# Altium project MaverickPowerDistribution_v1.0.PrjPcb
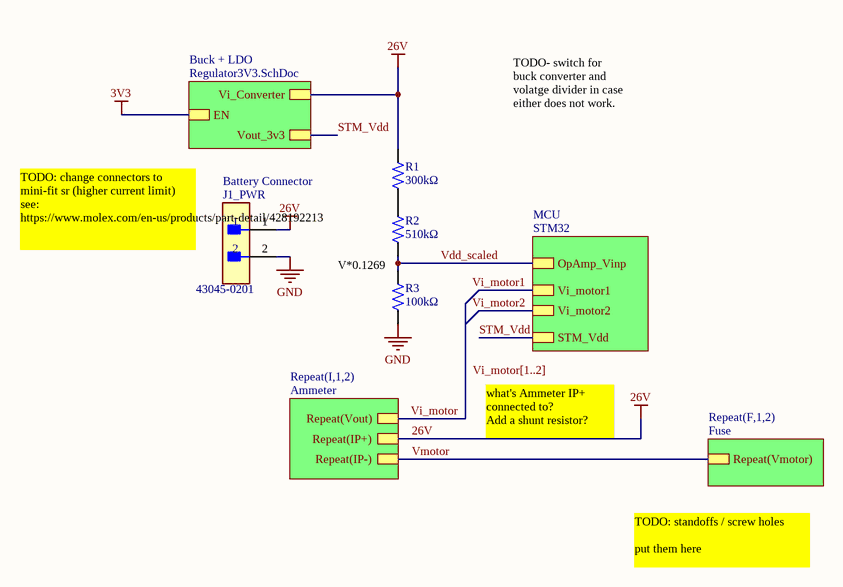
[diagram p0: Power.SchDoc]
7 sheets, 69 parts. Net scope: hierarchical (ports join the sheet entries above them; power ports are global).
Board file: PCB1.PcbDoc
Sheets:
  Power.SchDoc
    I1 = Ammeter.SchDoc
    I2 = Ammeter.SchDoc
    MCU = STM32.SchDoc
      Mass Storage = MicroSD.SchDoc
      Debugger = SWD.SchDoc
    F1 = Fuse.SchDoc
    F2 = Fuse.SchDoc
    Buck + LDO = Regulator3V3.SchDoc

## Sheet Power.SchDoc
size A; SheetNumber: 1; SheetTotal: 8

### Parts
J1_PWR  43045-0201  [FP-43045-0201-MFG]
R1  Resistance: 300kΩ  [RES-0603]  (hidden comment: 0603WAF3003T5E)
R2  Resistance: 510kΩ  [RES-0603]  (hidden comment: 0603WAF5103T5E)
R3  Resistance: 100kΩ  [RES-0402]  (hidden comment: 0402WGF1003TCE)

### Sub-sheets
Buck + LDO = Regulator3V3.SchDoc: Vi_Converter, Vout_3v3, EN
MCU = STM32: Vi_motor1, Vi_motor2, OpAmp_Vinp, STM_Vdd
Repeat(F,1,2) = Fuse: Repeat(Vmotor)
Repeat(I,1,2) = Ammeter: Repeat(Vout), Repeat(IP-), Repeat(IP+)

### Nets
26V: J1_PWR.1 R1.2 ; sheet Repeat(I,1,2)/Repeat(IP+), sheet Buck + LDO/Vi_Converter
GND: J1_PWR.2 R3.1
STM_Vdd: sheet MCU/STM_Vdd, sheet Buck + LDO/Vout_3v3
Vdd_scaled: R2.1 R3.2 ; sheet MCU/OpAmp_Vinp  [project net OPAMP1_VINP]
Vi_motor: sheet Repeat(I,1,2)/Repeat(Vout)
Vmotor: sheet Repeat(I,1,2)/Repeat(IP-), sheet Repeat(F,1,2)/Repeat(Vmotor)
NetR1_1: R1.1 R2.2

### Buses and harness runs
bus Vi_motor[1..2]

### Notes on the sheet
- (near J1_PWR) Battery Connector
- TODO- switch for buck converter and volatge divider in case either does not work.
- TODO: change connectors to mini-fit sr (higher current limit)
  see: https://www.molex.com/en-us/products/part-detail/428192213
- V*0.1269
- what's Ammeter IP+ connected to?
  Add a shunt resistor?
- TODO: standoffs / screw holes
  put them here
- Labels drawn without touching a wire or pin: Vi_motor[1..2]

### Library data of the parts
J1_PWR = CMP-04776-000998-1: CONN HEADER R/A 2POS; Number of Circuits: 2; Glow Wire Compliant: Compliant; Pitch: 3mm; Max Voltage Rating (DC): 250.25kV; Current Rating: 5A; Contact Resistance: 10mR; Gender: Male; Voltage Rating: 250V; Number of Positions: 2; Halogen Free: Low Halogen; Series: 43045; Mount: Through Hole; Packaging: Tray; Row Spacing: 3mm; Contact Material: Brass; Radiation Hardening: No; Number of Contacts: 2; Orientation: Right Angle; Max Operating Temperature: 105°C; Housing Material: Thermoplastic; Contact Plating: Gold; Case/Package: 0201; Number of Rows: 2; Min Operating Temperature: -40°C; Termination: Solder; Package Quantity: 3168
R1 = 0603WAF3003T5E: Resistor, 300kΩ, ±1%, 100mW, 75V, ±100ppm/℃, -55℃~+155℃, SMD 0603; Manufacturer: Uniroyal; Supplier 1: LCSC; Manufacturer Part Number: 0603WAF3003T5E; Supplier Part Number 1: C23024; JLCPCB Part Number: C23024; Power Rating: 100mW; Category: Resistors; Package Size: 0603; JLCPCB Basic Part: Yes; Tolerance: ±1%; Voltage Rating: 75V; Temperature Coefficient: ±100ppm/℃; Temperature Rating: -55℃~+155℃; ComponentLink1Description: Datasheet; ComponentLink1URL: https://wmsc.lcsc.com/wmsc/upload/file/pdf/v2/lcsc/2206010116_UNI-ROYAL-Uniroyal-Elec-0603WAF3003T5E_C23024.pdf; ComponentLink2Description: JLCPCB Part URL; ComponentLink2URL: https://jlcpcb.com/partdetail/C23024
R2 = 0603WAF5103T5E: Resistor, 510kΩ, ±1%, 100mW, 75V, ±100ppm/℃, -55℃~+155℃, SMD 0603; Manufacturer: Uniroyal; Supplier 1: LCSC; Manufacturer Part Number: 0603WAF5103T5E; Supplier Part Number 1: C23192; JLCPCB Part Number: C23192; Power Rating: 100mW; Category: Resistors; Package Size: 0603; JLCPCB Basic Part: Yes; Tolerance: ±1%; Voltage Rating: 75V; Temperature Coefficient: ±100ppm/℃; Temperature Rating: -55℃~+155℃; ComponentLink1Description: Datasheet; ComponentLink1URL: https://wmsc.lcsc.com/wmsc/upload/file/pdf/v2/lcsc/2206010116_UNI-ROYAL-Uniroyal-Elec-0603WAF5103T5E_C23192.pdf; ComponentLink2Description: JLCPCB Part URL; ComponentLink2URL: https://jlcpcb.com/partdetail/C23192
R3 = 0402WGF1003TCE: Resistor, 100kΩ, ±1%, 62.5mW, 50V, ±100ppm/℃, -55℃~+155℃, SMD 0402; Manufacturer: Uniroyal; Supplier 1: LCSC; Manufacturer Part Number: 0402WGF1003TCE; Supplier Part Number 1: C25741; JLCPCB Part Number: C25741; Power Rating: 62.5mW; Category: Resistors; Package Size: 0402; JLCPCB Basic Part: Yes; Tolerance: ±1%; Voltage Rating: 50V; Temperature Coefficient: ±100ppm/℃; Temperature Rating: -55℃~+155℃; ComponentLink1Description: Datasheet; ComponentLink1URL: https://wmsc.lcsc.com/wmsc/upload/file/pdf/v2/lcsc/2206010100_UNI-ROYAL-Uniroyal-Elec-0402WGF1003TCE_C25741.pdf; ComponentLink2Description: JLCPCB Part URL; ComponentLink2URL: https://jlcpcb.com/partdetail/C25741

## Sheet Ammeter.SchDoc
size A; SheetNumber: 7; SheetTotal: 8; SPICEModelCacheFFTHAXDY: <root> / <DocumentId>FFTHAXDY</DocumentId> / </root>
Used 2 times, as channels I1, I2. Parts and nets are listed once, with the designators drawn on the sheet.
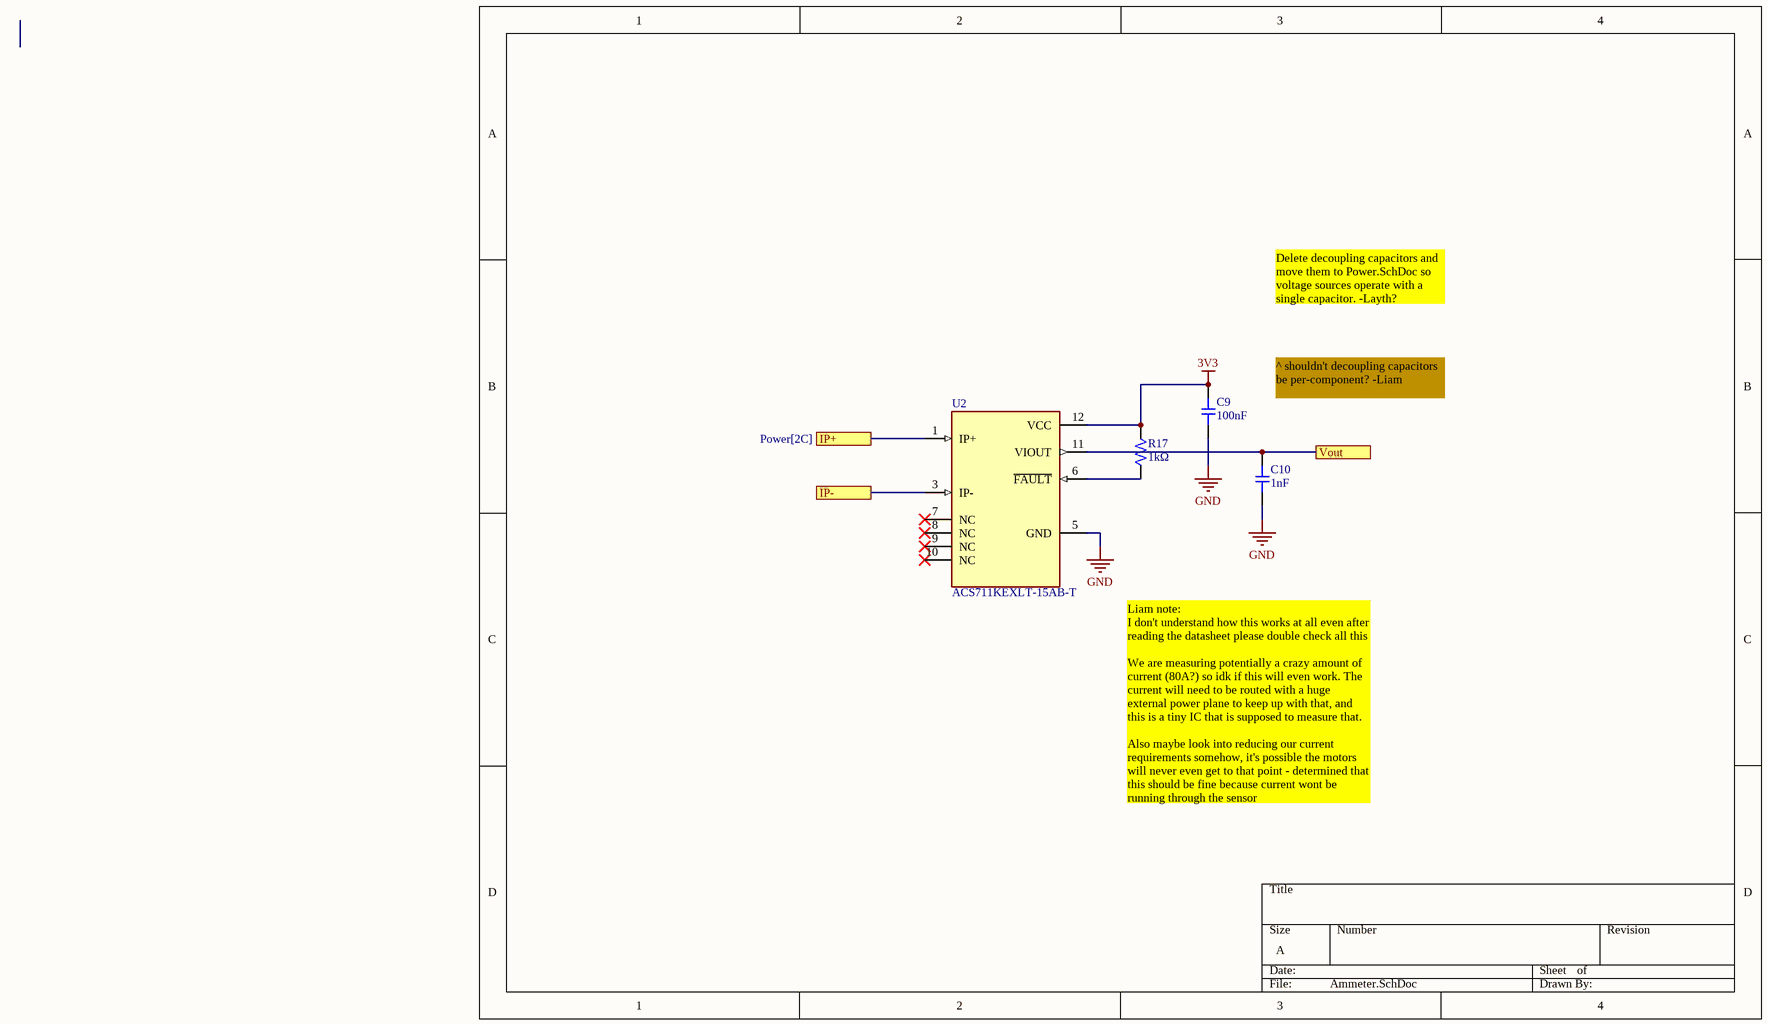
[diagram p1: Ammeter.SchDoc]

### Parts
C9  Capacitance: 100nF  [CAP-0805]  (hidden comment: CC0805KRX7R9BB104)
C10  Capacitance: 1nF  [CAP-0805]  (hidden comment: CL21B102KBCNNNC)
R17  Resistance: 1kΩ  [RES-0603]
U2  ACS711KEXLT-15AB-T  [XDCR_ACS711KEXLT-15AB-T]

### Ports
IP+ (see Power[2C]), IP- (see Power[2C]), Vout (see Power[2C])

### Nets
3V3: C9.2 R17.2 U2.12(VCC)
GND: C9.1 C10.1 U2.5(GND)
IP+: U2.1(IP+) ; port IP+
IP-: U2.3(IP-) ; port IP-
Vout: C10.2 U2.11(VIOUT) ; port Vout
NetR17_1: R17.1 U2.6(~{FAULT})

Not connected (* = marked no-connect by the designer): U2 7(NC)* 8(NC)* 9(NC)* 10(NC)*

### Channels
I1: designators end in A; ports IP+=26V1 IP-=Vmotor1 Vout=ADC1_IN9
I2: designators end in B; ports IP+=26V2 IP-=Vmotor2 Vout=ADC1_IN10

### Notes on the sheet
- Delete decoupling capacitors and move them to Power.SchDoc so voltage sources operate with a single capacitor. -Layth?
- ^ shouldn't decoupling capacitors be per-component? -Liam
- Liam note:
  I don't understand how this works at all even after reading the datasheet please double check all this
  We are measuring potentially a crazy amount of current (80A?) so idk if this will even work. The current will need to be routed with a huge external power plane to keep up with that, and this is a tiny IC that is supposed to measure that.
  Also maybe look into reducing our current requirements somehow, it's possible the motors will never even get to that point - determined that this should be fine because current wont be running through the sensor

### Library data of the parts
C9 = CC0805KRX7R9BB104: Capacitor, Ceramic (MLCC), 100nF, ±10%, 50V, X7R, ±10%, SMD 0805; Manufacturer: YAGEO; Package Size: 0805; JLCPCB Basic Part: Yes; JLCPCB Part Number: C49678; Supplier 1: LCSC; Category: Capacitors - MLCC; Supplier Part Number 1: C49678; Manufacturer Part Number: CC0805KRX7R9BB104; Tolerance: ±10%; Voltage Rating: 50V; Temperature Coefficient: X7R; RoHS: Yes; ComponentLink1Description: Datasheet; ComponentLink1URL: https://wmsc.lcsc.com/wmsc/upload/file/pdf/v2/lcsc/2304140030_YAGEO-CC0805KRX7R9BB104_C49678.pdf; ComponentLink2Description: JLCPCB Part URL; ComponentLink2URL: https://jlcpcb.com/partdetail/C49678; ComponentLink3Description: LCSC Part URL; ComponentLink3URL: https://lcsc.com/product-detail/Multilayer-Ceramic-Capacitors-MLCC---SMD-SMT_YAGEO-YAGEO-CC0805KRX7R9BB104_C49678.html
C10 = CL21B102KBCNNNC: Capacitor, Ceramic (MLCC), 1nF, ±10%, 50V, X7R, ±10%, SMD 0805; Manufacturer: Samsung Electro-Mechanics; Temperature Rating: -55°C ~ 125°C; Capacitance @ 1V DC Bias: 1.006nF; Capacitance @ 1.2V DC Bias: 1.008nF; Capacitance @ 1.35V DC Bias: 1.009nF; Capacitance @ 1.8V DC Bias: 1.011nF; Capacitance @ 2.5V DC Bias: 1.013nF; Capacitance @ 3.3V DC Bias: 1.014nF; Capacitance @ 3.7V DC Bias: 1.015nF; Capacitance @ 4.2V DC Bias: 1.017nF; Capacitance @ 5V DC Bias: 1.018nF; Capacitance @ 9V DC Bias: 1.022nF; Capacitance @ 12V DC Bias: 1.021nF; Capacitance @ 15V DC Bias: 1.020nF; Capacitance @ 24V DC Bias: 1.012nF; Capacitance @ 36V DC Bias: 0.995nF; Capacitance @ 48V DC Bias: 0.975nF; Impedance (0V Bias) @ 100Hz: 1.39E+06Ω; Impedance (0V Bias) @ 500Hz: 2.85E+05Ω; Impedance (0V Bias) @ 1kHz: 1.43E+05Ω; Impedance (0V Bias) @ 5kHz: 2.92E+04Ω; Impedance (0V Bias) @ 10kHz: 1.47E+04Ω; Impedance (0V Bias) @ 50kHz: 3E+03Ω; Impedance (0V Bias) @ 100kHz: 1.51E+03Ω; Impedance (0V Bias) @ 500kHz: 307Ω; Impedance (0V Bias) @ 1MHz: 155Ω; Impedance (0V Bias) @ 5MHz: 31.6Ω; Impedance (0V Bias) @ 10MHz: 15.9Ω; Impedance (0V Bias) @ 50MHz: 3.25Ω; Impedance (0V Bias) @ 100MHz: 1.41Ω; Impedance (0V Bias) @ 500MHz: 1.58Ω; Impedance (0V Bias) @ 1GHz: 3.83Ω; Impedance (0V Bias) @ 2GHz: 12.4Ω; Impedance (0V Bias) @ 5GHz: 7.64Ω; Package Size: 0805; JLCPCB Basic Part: Yes; JLCPCB Part Number: C46653; Supplier 1: LCSC; Category: Capacitors - MLCC; Supplier Part Number 1: C46653; Manufacturer Part Number: CL21B102KBCNNNC; Tolerance: ±10%; Voltage Rating: 50V; Temperature Coefficient: X7R; RoHS: Yes; ComponentLink1Description: Datasheet; ComponentLink1URL: https://wmsc.lcsc.com/wmsc/upload/file/pdf/v2/lcsc/2304140030_Samsung-Electro-Mechanics-CL21B102KBCNNNC_C46653.pdf; ComponentLink2Description: JLCPCB Part URL; ComponentLink2URL: https://jlcpcb.com/partdetail/C46653; ComponentLink3Description: LCSC Part URL; ComponentLink3URL: https://lcsc.com/product-detail/Multilayer-Ceramic-Capacitors-MLCC---SMD-SMT_Samsung-Electro-Mechanics-Samsung-Electro-Mechanics-CL21B102KBCNNNC_C46653.html; ComponentLink4Description: Samsung Component Library; ComponentLink4URL: https://weblib.samsungsem.com/mlcc/mlcc-ec.do?partNumber=CL21B102KBCNNN; Capacitance @ 1.5V DC Bias: 1.009nF
R17 = 0603WAF1001T5E: Resistor, 1kΩ, ±1%, 100mW, 75V, ±100ppm/℃, -55℃~+155℃, SMD 0603; Manufacturer: Uniroyal; Supplier 1: LCSC; Manufacturer Part Number: 0603WAF1001T5E; Supplier Part Number 1: C21190; JLCPCB Part Number: C21190; Power Rating: 100mW; Category: Resistors; Package Size: 0603; JLCPCB Basic Part: Yes; Tolerance: ±1%; Voltage Rating: 75V; Temperature Coefficient: ±100ppm/℃; Temperature Rating: -55℃~+155℃; ComponentLink1Description: Datasheet; ComponentLink1URL: https://wmsc.lcsc.com/wmsc/upload/file/pdf/v2/lcsc/2206010130_UNI-ROYAL-Uniroyal-Elec-0603WAF1001T5E_C21190.pdf; ComponentLink2Description: JLCPCB Part URL; ComponentLink2URL: https://jlcpcb.com/partdetail/C21190
U2 = ACS711KEXLT-15AB-T: Current Sensor 15.5A 1 Channel Hall Effect, Open Loop Bidirectional 12-PowerWFQFN; MF: Allegro MicroSystems LLC; Package: PowerWFQFN-12 Allegro MicroSystems LLC; Value: *; MP: ACS711KEXLT-15AB-T; SnapEDA_Link: https://www.snapeda.com/parts/ACS711KEXLT-15AB-T/Allegro/view-part/?ref=snap; Check_prices: https://www.snapeda.com/parts/ACS711KEXLT-15AB-T/Allegro/view-part/?ref=eda

## Sheet STM32.SchDoc
size A; SheetNumber: 3; SheetTotal: 8
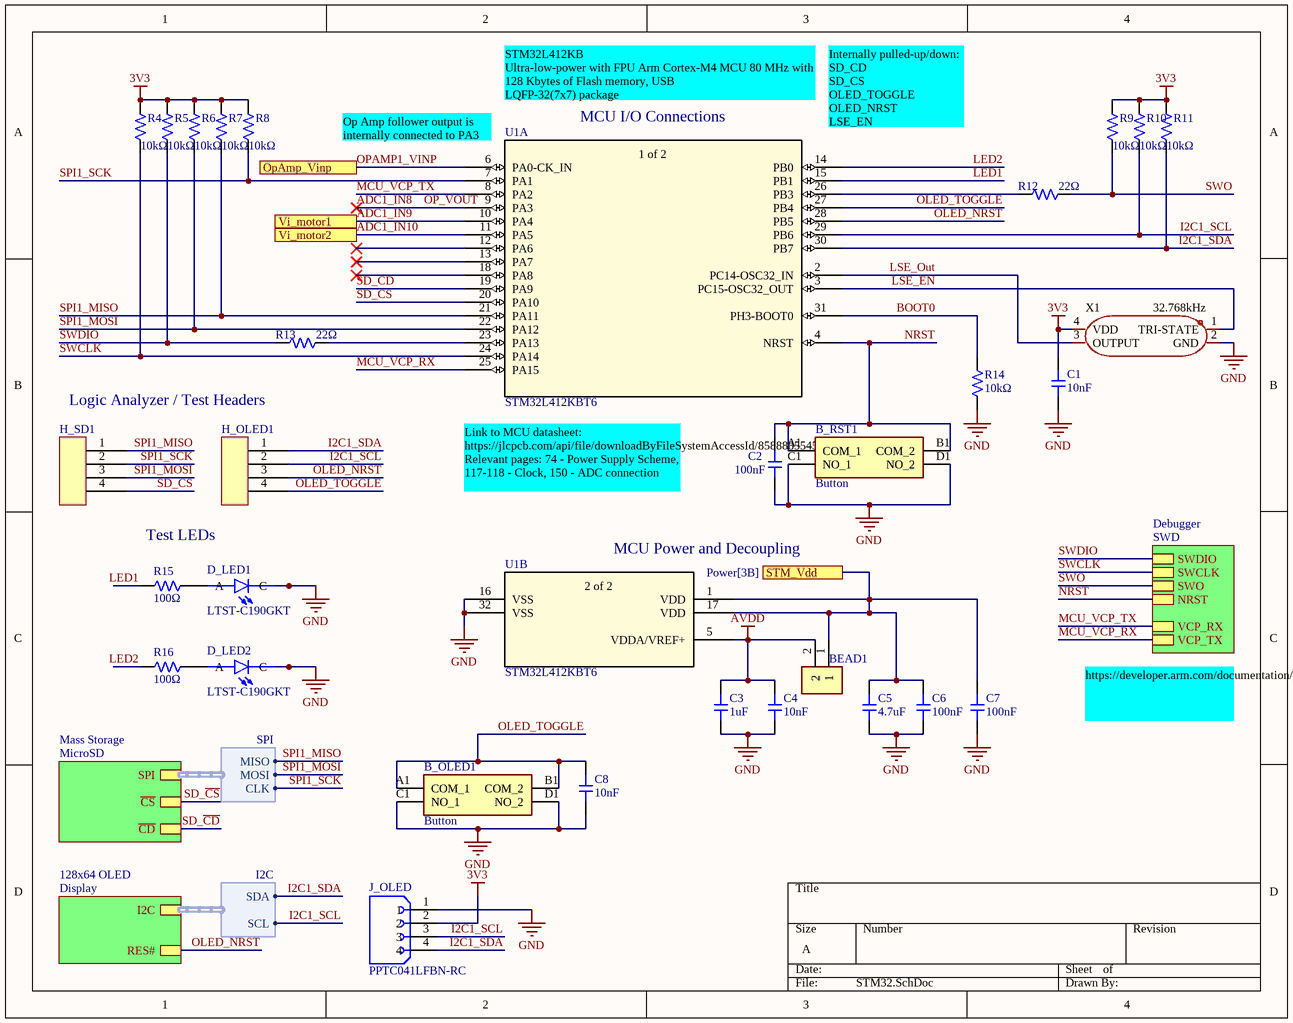
[diagram p2: STM32.SchDoc]

### Parts
B_OLED1  Button  [TS1187ABAB]
B_RST1  Button  [TS1187ABAB]
BEAD1  GZ1608D601TF  [BEADC1608X95N]  (value not drawn)
C1  Capacitance: 10nF  [CAP-0402]  (hidden comment: CL05B103KB5NNNC)
C2  Capacitance: 100nF  [CAP-0402]  (hidden comment: CL05B104KB54PNC)
C3  Capacitance: 1uF  [CAP-0402]  (hidden comment: CL05A105KA5NQNC)
C4  Capacitance: 10nF  [CAP-0402]  (hidden comment: CL05B103KB5NNNC)
C5  Capacitance: 4.7uF  [CAP-0402]  (hidden comment: CL05A475MP5NRNC)
C6  Capacitance: 100nF  [CAP-0402]  (hidden comment: CL05B104KO5NNNC)
C7  Capacitance: 100nF  [CAP-0402]  (hidden comment: CL05B104KO5NNNC)
C8  Capacitance: 10nF  [CAP-0402]  (hidden comment: CL05B103KB5NNNC)
D_LED1  LTST-C190GKT  [LEDM1608X80]
D_LED2  LTST-C190GKT  [LEDM1608X80]
H_OLED1  4-pin Header  [4-pin Header]  (value not drawn)
H_SD1  4-pin Header  [4-pin Header]  (value not drawn)
J_OLED  PPTC041LFBN-RC  [SULLINS_PPTC041LFBN-RC]
R4  Resistance: 10kΩ  [RES-0402]  (hidden comment: 0402WGF1002TCE)
R5  Resistance: 10kΩ  [RES-0402]  (hidden comment: 0402WGF1002TCE)
R6  Resistance: 10kΩ  [RES-0402]  (hidden comment: 0402WGF1002TCE)
R7  Resistance: 10kΩ  [RES-0402]  (hidden comment: 0402WGF1002TCE)
R8  Resistance: 10kΩ  [RES-0402]  (hidden comment: 0402WGF1002TCE)
R9  Resistance: 10kΩ  [RES-0402]  (hidden comment: 0402WGF1002TCE)
R10  Resistance: 10kΩ  [RES-0402]  (hidden comment: 0402WGF1002TCE)
R11  Resistance: 10kΩ  [RES-0402]  (hidden comment: 0402WGF1002TCE)
R12  Resistance: 22Ω  [RES-0402]  (hidden comment: 0402WGF220JTCE)
R13  Resistance: 22Ω  [RES-0402]  (hidden comment: 0402WGF220JTCE)
R14  Resistance: 10kΩ  [RES-0402]  (hidden comment: 0402WGF1002TCE)
R15  Resistance: 100Ω  [RES-0402]  (hidden comment: 0402WGF1000TCE)
R16  Resistance: 100Ω  [RES-0402]  (hidden comment: 0402WGF1000TCE)
U1  STM32L412KBT6  [LQFP-32]  (parts A,B of 2)
X1  32.768kHz  [OSC-SMD_4P-L3.2-W2.5-BL]

### Sub-sheets
128x64 OLED = Display (file not in this document): I2C (harness I2C), RES#
Debugger = SWD: SWDIO, SWCLK, SWO, NRST, VCP_TX, VCP_RX
Mass Storage = MicroSD: SPI (harness SPI), ~{CS}, ~{CD}

### Ports
OpAmp_Vinp (see Power[3B]), STM_Vdd (see Power[3B]), Vi_motor1 (see Power[3B]), Vi_motor2 (see Power[3B])

### Harnesses
SPI: MISO, MOSI, CLK
I2C: SDA, SCL

### Nets
3V3: C1.2 J_OLED.2 R4.2 R5.2 R6.2 R7.2 R8.2 R9.2 R10.2 R11.2 X1.4(VDD)
AVDD: BEAD1.2 C3.2 C4.2 U1.5(VDDA/VREF+)
GND: B_OLED1.C1(NO_1) B_OLED1.D1(NO_2) B_RST1.C1(NO_1) B_RST1.D1(NO_2) C1.1 C2.1 C3.1 C4.1 C5.1 C6.1 C7.1 C8.1 D_LED1.C D_LED2.C J_OLED.1 R14.1 U1.16(VSS) U1.32(VSS) X1.2(GND)
ADC1_IN8: U1.9(PA3)  [also labelled OP_VOUT]
ADC1_IN9: U1.10(PA4) ; port Vi_motor1
ADC1_IN10: U1.11(PA5) ; port Vi_motor2
BOOT0: R14.2 U1.31(PH3-BOOT0)
I2C1_SCL: H_OLED1.2 J_OLED.3 R10.1 U1.29(PB6) ; sheet 128x64 OLED/I2C.SCL
I2C1_SDA: H_OLED1.1 J_OLED.4 R11.1 U1.30(PB7) ; sheet 128x64 OLED/I2C.SDA
LED1: R15.1 U1.15(PB1)
LED2: R16.1 U1.14(PB0)
LSE_EN: U1.3(PC15-OSC32_OUT) X1.1(TRI-STATE)
LSE_Out: U1.2(PC14-OSC32_IN) X1.3(OUTPUT)
MCU_VCP_RX: U1.25(PA15) ; sheet Debugger/VCP_TX
MCU_VCP_TX: U1.8(PA2) ; sheet Debugger/VCP_RX
NRST: B_RST1.A1(COM_1) B_RST1.B1(COM_2) C2.2 U1.4(NRST) ; sheet Debugger/NRST
OLED_NRST: H_OLED1.3 U1.28(PB5) ; sheet 128x64 OLED/RES#
OLED_TOGGLE: B_OLED1.A1(COM_1) B_OLED1.B1(COM_2) C8.2 H_OLED1.4 U1.27(PB4)
OPAMP1_VINP: U1.6(PA0-CK_IN) ; port OpAmp_Vinp
SD_~{CD}: U1.19(PA9) ; sheet Mass Storage/~{CD}  [project net CardDetect]
SD_~{CS}: H_SD1.4 U1.20(PA10) ; sheet Mass Storage/~{CS}  [project net ~{CS}]
SPI1_MISO: H_SD1.1 R7.1 U1.21(PA11) ; sheet Mass Storage/SPI.MISO  [project net SPI.MISO]
SPI1_MOSI: H_SD1.3 R6.1 U1.22(PA12) ; sheet Mass Storage/SPI.MOSI  [project net SPI.MOSI]
SPI1_SCK: H_SD1.2 R8.1 U1.7(PA1) ; sheet Mass Storage/SPI.CLK  [project net SPI.CLK]
STM_Vdd: BEAD1.1 C5.2 C6.2 C7.2 U1.1(VDD) U1.17(VDD) ; port STM_Vdd
SWCLK: R4.1 U1.24(PA14) ; sheet Debugger/SWCLK
SWDIO: R5.1 R13.1 ; sheet Debugger/SWDIO
SWO: R9.1 R12.2 ; sheet Debugger/SWO
NetD_LED1_A: D_LED1.A R15.2
NetD_LED2_A: D_LED2.A R16.2
NetR12_1: R12.1 U1.26(PB3)
NetR13_2: R13.2 U1.23(PA13)

Not connected (* = marked no-connect by the designer): U1 12(PA6)* 13(PA7)* 18(PA8)*

### Notes on the sheet
- STM32L412KB
  Ultra-low-power with FPU Arm Cortex-M4 MCU 80 MHz with 128 Kbytes of Flash memory, USB
  LQFP-32(7x7) package
- (near U1) Op Amp follower output is internally connected to PA3
- (near U1) MCU I/O Connections
- (near U1) Internally pulled-up/down:
  SD_CD
  SD_CS
  OLED_TOGGLE
  OLED_NRST
  LSE_EN
- Logic Analyzer / Test Headers
- Link to MCU datasheet: https://jlcpcb.com/api/file/downloadByFileSystemAccessId/8588885545674424320
  Relevant pages: 74 - Power Supply Scheme, 117-118 - Clock, 150 - ADC connection
- Test LEDs
- MCU Power and Decoupling
- https://developer.arm.com/documentation/dui0499/a/Target-Interface-Connections/SWD-connections
- (in symbol STM32L412KBT6, part A) 1 of 2
- (in symbol STM32L412KBT6, part B) 2 of 2

### Library data of the parts
B_OLED1 B_RST1 = TS-1187A-B-A-B: Manufacturer_Name: XKB Connectivity; Datasheet Link: http://www.helloxkb.com/public/images/pdf/TS-1187A-X-X-X.pdf; Height: 4.05mm; Manufacturer_Part_Number: TS-1187A-B-A-B
BEAD1 = GZ1608D601TF: Ferrite Bead; Manufacturer_Name: SUNLORD; Datasheet Link: https://datasheet.lcsc.com/szlcsc/Sunlord-GZ1608D601TF_C1002.pdf; Height: 0.95mm; Manufacturer_Part_Number: GZ1608D601TF
C1 C4 C8 = CL05B103KB5NNNC: Capacitor, Ceramic (MLCC), 10nF, ±10%, 50V, X7R, ±10%, SMD 0402; Manufacturer: Samsung Electro-Mechanics; Temperature Rating: -55°C ~ 125°C; Capacitance @ 1V DC Bias: 10.426nF; Capacitance @ 1.2V DC Bias: 10.434nF; Capacitance @ 1.35V DC Bias: 10.444nF; Capacitance @ 1.5V DC Bias: 10.455nF; Capacitance @ 1.8V DC Bias: 10.480nF; Capacitance @ 2.5V DC Bias: 10.514nF; Capacitance @ 3.3V DC Bias: 10.519nF; Capacitance @ 3.7V DC Bias: 10.504nF; Capacitance @ 4.2V DC Bias: 10.473nF; Capacitance @ 5V DC Bias: 10.402nF; Capacitance @ 9V DC Bias: 10.052nF; Capacitance @ 12V DC Bias: 9.639nF; Capacitance @ 15V DC Bias: 9.187nF; Capacitance @ 24V DC Bias: 7.606nF; Capacitance @ 36V DC Bias: 5.499nF; Capacitance @ 48V DC Bias: 3.591nF; Impedance (0V Bias) @ 100Hz: 1.57E+05Ω; Impedance (0V Bias) @ 500Hz: 3.19E+04Ω; Impedance (0V Bias) @ 1kHz: 1.61E+04Ω; Impedance (0V Bias) @ 5kHz: 3.27E+03Ω; Impedance (0V Bias) @ 10kHz: 1.65E+03Ω; Impedance (0V Bias) @ 50kHz: 335Ω; Impedance (0V Bias) @ 100kHz: 169Ω; Impedance (0V Bias) @ 500kHz: 34.3Ω; Impedance (0V Bias) @ 1MHz: 17.3Ω; Impedance (0V Bias) @ 5MHz: 3.52Ω; Impedance (0V Bias) @ 10MHz: 1.77Ω; Impedance (0V Bias) @ 50MHz: 0.285Ω; Impedance (0V Bias) @ 100MHz: 0.0835Ω; Impedance (0V Bias) @ 500MHz: 0.751Ω; Impedance (0V Bias) @ 1GHz: 1.42Ω; Impedance (0V Bias) @ 2GHz: 3.22Ω; Impedance (0V Bias) @ 5GHz: 6.48Ω; Package Size: 0402; JLCPCB Basic Part: Yes; JLCPCB Part Number: C15195; Supplier 1: LCSC; Category: Capacitors - MLCC; Supplier Part Number 1: C15195; Manufacturer Part Number: CL05B103KB5NNNC; Tolerance: ±10%; Voltage Rating: 50V; Temperature Coefficient: X7R; RoHS: Yes; ComponentLink1Description: Datasheet; ComponentLink1URL: https://wmsc.lcsc.com/wmsc/upload/file/pdf/v2/lcsc/2304140030_Samsung-Electro-Mechanics-CL05B103KB5NNNC_C15195.pdf; ComponentLink2Description: JLCPCB Part URL; ComponentLink2URL: https://jlcpcb.com/partdetail/C15195; ComponentLink3Description: LCSC Part URL; ComponentLink3URL: https://lcsc.com/product-detail/Multilayer-Ceramic-Capacitors-MLCC---SMD-SMT_Samsung-Electro-Mechanics-Samsung-Electro-Mechanics-CL05B103KB5NNNC_C15195.html; ComponentLink4Description: Samsung Component Library; ComponentLink4URL: https://weblib.samsungsem.com/mlcc/mlcc-ec.do?partNumber=CL05B103KB5NNN
C2 = CL05B104KB54PNC: Capacitor, Ceramic (MLCC), 100nF, ±10%, 50V, X7R, ±10%, SMD 0402; Manufacturer: Samsung Electro-Mechanics; Temperature Rating: -55°C ~ 125°C; Capacitance @ 1V DC Bias: 105.687nF; Capacitance @ 1.2V DC Bias: 105.639nF; Capacitance @ 1.35V DC Bias: 105.594nF; Capacitance @ 1.5V DC Bias: 105.528nF; Capacitance @ 1.8V DC Bias: 105.317nF; Capacitance @ 2.5V DC Bias: 104.216nF; Capacitance @ 3.3V DC Bias: 102.385nF; Capacitance @ 3.7V DC Bias: 101.236nF; Capacitance @ 4.2V DC Bias: 99.650nF; Capacitance @ 5V DC Bias: 96.918nF; Capacitance @ 9V DC Bias: 81.073nF; Capacitance @ 12V DC Bias: 69.786nF; Capacitance @ 15V DC Bias: 59.475nF; Capacitance @ 24V DC Bias: 38.112nF; Capacitance @ 36V DC Bias: 23.027nF; Capacitance @ 48V DC Bias: 16.035nF; Impedance (0V Bias) @ 100Hz: 1.66E+04Ω; Impedance (0V Bias) @ 500Hz: 3.38E+03Ω; Impedance (0V Bias) @ 1kHz: 1.7E+03Ω; Impedance (0V Bias) @ 5kHz: 346Ω; Impedance (0V Bias) @ 10kHz: 175Ω; Impedance (0V Bias) @ 50kHz: 35.5Ω; Impedance (0V Bias) @ 100kHz: 17.9Ω; Impedance (0V Bias) @ 500kHz: 3.64Ω; Impedance (0V Bias) @ 1MHz: 1.84Ω; Impedance (0V Bias) @ 5MHz: 0.366Ω; Impedance (0V Bias) @ 10MHz: 0.172Ω; Impedance (0V Bias) @ 50MHz: 0.0626Ω; Impedance (0V Bias) @ 100MHz: 0.128Ω; Impedance (0V Bias) @ 500MHz: 0.487Ω; Impedance (0V Bias) @ 1GHz: 0.87Ω; Impedance (0V Bias) @ 2GHz: 2Ω; Impedance (0V Bias) @ 5GHz: 3.96Ω; Package Size: 0402; JLCPCB Basic Part: Yes; JLCPCB Part Number: C307331; Supplier 1: LCSC; Category: Capacitors - MLCC; Supplier Part Number 1: C307331; Manufacturer Part Number: CL05B104KB54PNC; Tolerance: ±10%; Voltage Rating: 50V; Temperature Coefficient: X7R; RoHS: Yes; ComponentLink1Description: Datasheet; ComponentLink1URL: https://wmsc.lcsc.com/wmsc/upload/file/pdf/v2/lcsc/2304140030_Samsung-Electro-Mechanics-CL05B104KB54PNC_C307331.pdf; ComponentLink2Description: JLCPCB Part URL; ComponentLink2URL: https://jlcpcb.com/partdetail/C307331; ComponentLink3Description: LCSC Part URL; ComponentLink3URL: https://lcsc.com/product-detail/Multilayer-Ceramic-Capacitors-MLCC---SMD-SMT_Samsung-Electro-Mechanics-Samsung-Electro-Mechanics-CL05B104KB54PNC_C307331.html; ComponentLink4Description: Samsung Component Library; ComponentLink4URL: https://weblib.samsungsem.com/mlcc/mlcc-ec.do?partNumber=CL05B104KB54PN
C3 = CL05A105KA5NQNC: Capacitor, Ceramic (MLCC), 1uF, ±10%, 25V, X5R, ±10%, SMD 0402; Manufacturer: Samsung Electro-Mechanics; Temperature Rating: -55°C ~ 85°C; Capacitance @ 1V DC Bias: 1.014uF; Capacitance @ 1.2V DC Bias: 0.983uF; Capacitance @ 1.35V DC Bias: 0.958uF; Capacitance @ 1.5V DC Bias: 0.932uF; Capacitance @ 1.8V DC Bias: 0.879uF; Capacitance @ 2.5V DC Bias: 0.755uF; Capacitance @ 3.3V DC Bias: 0.618uF; Capacitance @ 3.7V DC Bias: 0.562uF; Capacitance @ 4.2V DC Bias: 0.501uF; Capacitance @ 5V DC Bias: 0.420uF; Capacitance @ 9V DC Bias: 0.204uF; Capacitance @ 12V DC Bias: 0.147uF; Capacitance @ 15V DC Bias: 0.107uF; Capacitance @ 24V DC Bias: 0.061uF; Impedance (0V Bias) @ 100Hz: 1.95E+03Ω; Impedance (0V Bias) @ 500Hz: 402Ω; Impedance (0V Bias) @ 1kHz: 204Ω; Impedance (0V Bias) @ 5kHz: 42Ω; Impedance (0V Bias) @ 10kHz: 21.3Ω; Impedance (0V Bias) @ 50kHz: 4.4Ω; Impedance (0V Bias) @ 100kHz: 2.23Ω; Impedance (0V Bias) @ 500kHz: 0.462Ω; Impedance (0V Bias) @ 1MHz: 0.234Ω; Impedance (0V Bias) @ 5MHz: 0.0392Ω; Impedance (0V Bias) @ 10MHz: 0.0118Ω; Impedance (0V Bias) @ 50MHz: 0.0671Ω; Impedance (0V Bias) @ 100MHz: 0.118Ω; Impedance (0V Bias) @ 500MHz: 0.452Ω; Impedance (0V Bias) @ 1GHz: 0.812Ω; Impedance (0V Bias) @ 2GHz: 1.8Ω; Impedance (0V Bias) @ 5GHz: 3.57Ω; Impedance (25V Bias) @ 100Hz: 2.62E+04Ω; Impedance (25V Bias) @ 500Hz: 5.28E+03Ω; Impedance (25V Bias) @ 1kHz: 2.65E+03Ω; Impedance (25V Bias) @ 5kHz: 533Ω; Impedance (25V Bias) @ 10kHz: 267Ω; Impedance (25V Bias) @ 50kHz: 53.8Ω; Impedance (25V Bias) @ 100kHz: 27Ω; Impedance (25V Bias) @ 500kHz: 5.42Ω; Impedance (25V Bias) @ 1MHz: 2.7Ω; Impedance (25V Bias) @ 5MHz: 0.621Ω; Impedance (25V Bias) @ 10MHz: 0.298Ω; Impedance (25V Bias) @ 50MHz: 0.0523Ω; Impedance (25V Bias) @ 100MHz: 0.113Ω; Impedance (25V Bias) @ 500MHz: 0.451Ω; Impedance (25V Bias) @ 1GHz: 0.82Ω; Impedance (25V Bias) @ 2GHz: 1.85Ω; Impedance (25V Bias) @ 5GHz: 3.51Ω; Package Size: 0402; JLCPCB Basic Part: Yes; JLCPCB Part Number: C52923; Supplier 1: LCSC; Category: Capacitors - MLCC; Supplier Part Number 1: C52923; Manufacturer Part Number: CL05A105KA5NQNC; Tolerance: ±10%; Voltage Rating: 25V; Temperature Coefficient: X5R; RoHS: Yes; ComponentLink1Description: Datasheet; ComponentLink1URL: https://wmsc.lcsc.com/wmsc/upload/file/pdf/v2/lcsc/2304140030_Samsung-Electro-Mechanics-CL05A105KA5NQNC_C52923.pdf; ComponentLink2Description: JLCPCB Part URL; ComponentLink2URL: https://jlcpcb.com/partdetail/C52923; ComponentLink3Description: LCSC Part URL; ComponentLink3URL: https://lcsc.com/product-detail/Multilayer-Ceramic-Capacitors-MLCC---SMD-SMT_Samsung-Electro-Mechanics-Samsung-Electro-Mechanics-CL05A105KA5NQNC_C52923.html; ComponentLink4Description: Samsung Component Library; ComponentLink4URL: https://weblib.samsungsem.com/mlcc/mlcc-ec.do?partNumber=CL05A105KA5NQN
C5 = CL05A475MP5NRNC: Capacitor, Ceramic (MLCC), 4.7uF, ±20%, 10V, X5R, ±20%, SMD 0402; Manufacturer: Samsung Electro-Mechanics; Temperature Rating: -55°C ~ 85°C; Capacitance @ 1V DC Bias: 4.048uF; Capacitance @ 1.2V DC Bias: 3.816uF; Capacitance @ 1.35V DC Bias: 3.633uF; Capacitance @ 1.5V DC Bias: 3.450uF; Capacitance @ 1.8V DC Bias: 3.100uF; Capacitance @ 2.5V DC Bias: 2.453uF; Capacitance @ 3.3V DC Bias: 1.872uF; Capacitance @ 3.7V DC Bias: 1.663uF; Capacitance @ 4.2V DC Bias: 1.455uF; Capacitance @ 5V DC Bias: 1.191uF; Capacitance @ 9V DC Bias: 0.548uF; Impedance (0V Bias) @ 100Hz: 442Ω; Impedance (0V Bias) @ 500Hz: 90.2Ω; Impedance (0V Bias) @ 1kHz: 45.6Ω; Impedance (0V Bias) @ 5kHz: 9.34Ω; Impedance (0V Bias) @ 10kHz: 4.72Ω; Impedance (0V Bias) @ 50kHz: 0.964Ω; Impedance (0V Bias) @ 100kHz: 0.486Ω; Impedance (0V Bias) @ 500kHz: 0.0987Ω; Impedance (0V Bias) @ 1MHz: 0.0479Ω; Impedance (0V Bias) @ 5MHz: 0.00709Ω; Impedance (0V Bias) @ 10MHz: 0.0183Ω; Impedance (0V Bias) @ 50MHz: 0.06Ω; Impedance (0V Bias) @ 100MHz: 0.102Ω; Impedance (0V Bias) @ 500MHz: 0.377Ω; Impedance (0V Bias) @ 1GHz: 0.66Ω; Impedance (0V Bias) @ 2GHz: 1.52Ω; Impedance (0V Bias) @ 5GHz: 3.05Ω; Impedance (10V Bias) @ 100Hz: 3.34E+03Ω; Impedance (10V Bias) @ 500Hz: 674Ω; Impedance (10V Bias) @ 1kHz: 338Ω; Impedance (10V Bias) @ 5kHz: 68.2Ω; Impedance (10V Bias) @ 10kHz: 34.2Ω; Impedance (10V Bias) @ 50kHz: 6.88Ω; Impedance (10V Bias) @ 100kHz: 3.45Ω; Impedance (10V Bias) @ 500kHz: 0.693Ω; Impedance (10V Bias) @ 1MHz: 0.344Ω; Impedance (10V Bias) @ 5MHz: 0.0603Ω; Impedance (10V Bias) @ 10MHz: 0.0164Ω; Impedance (10V Bias) @ 50MHz: 0.064Ω; Impedance (10V Bias) @ 100MHz: 0.105Ω; Impedance (10V Bias) @ 500MHz: 0.385Ω; Impedance (10V Bias) @ 1GHz: 0.673Ω; Impedance (10V Bias) @ 5GHz: 3.06Ω; Package Size: 0402; JLCPCB Basic Part: Yes; JLCPCB Part Number: C23733; Supplier 1: LCSC; Category: Capacitors - MLCC; Supplier Part Number 1: C23733; Manufacturer Part Number: CL05A475MP5NRNC; Tolerance: ±20%; Voltage Rating: 10V; Temperature Coefficient: X5R; RoHS: Yes; ComponentLink1Description: Datasheet; ComponentLink1URL: https://wmsc.lcsc.com/wmsc/upload/file/pdf/v2/lcsc/2304140030_Samsung-Electro-Mechanics-CL05A475MP5NRNC_C23733.pdf; ComponentLink2Description: JLCPCB Part URL; ComponentLink2URL: https://jlcpcb.com/partdetail/C23733; ComponentLink3Description: LCSC Part URL; ComponentLink3URL: https://lcsc.com/product-detail/Multilayer-Ceramic-Capacitors-MLCC---SMD-SMT_Samsung-Electro-Mechanics-Samsung-Electro-Mechanics-CL05A475MP5NRNC_C23733.html; ComponentLink4Description: Samsung Component Library; ComponentLink4URL: https://weblib.samsungsem.com/mlcc/mlcc-ec.do?partNumber=CL05A475MP5NRN; Impedance (10V Bias) @ 2GHz: 1.52Ω
C6 C7 = CL05B104KO5NNNC: Capacitor, Ceramic (MLCC), 100nF, ±10%, 16V, X7R, ±10%, SMD 0402; Manufacturer: Samsung Electro-Mechanics; Temperature Rating: -55°C ~ 125°C; Capacitance @ 1V DC Bias: 104.721nF; Capacitance @ 1.2V DC Bias: 104.598nF; Capacitance @ 1.35V DC Bias: 104.495nF; Capacitance @ 1.5V DC Bias: 104.372nF; Capacitance @ 1.8V DC Bias: 104.042nF; Capacitance @ 2.5V DC Bias: 102.634nF; Capacitance @ 3.3V DC Bias: 100.452nF; Capacitance @ 3.7V DC Bias: 99.160nF; Capacitance @ 4.2V DC Bias: 97.441nF; Capacitance @ 5V DC Bias: 94.577nF; Capacitance @ 9V DC Bias: 78.638nF; Capacitance @ 12V DC Bias: 66.291nF; Capacitance @ 15V DC Bias: 54.779nF; Impedance (0V Bias) @ 100Hz: 1.71E+04Ω; Impedance (0V Bias) @ 500Hz: 3.48E+03Ω; Impedance (0V Bias) @ 1kHz: 1.75E+03Ω; Impedance (0V Bias) @ 5kHz: 356Ω; Impedance (0V Bias) @ 10kHz: 179Ω; Impedance (0V Bias) @ 50kHz: 36.4Ω; Impedance (0V Bias) @ 100kHz: 18.3Ω; Impedance (0V Bias) @ 500kHz: 3.72Ω; Impedance (0V Bias) @ 1MHz: 1.87Ω; Impedance (0V Bias) @ 5MHz: 0.373Ω; Impedance (0V Bias) @ 10MHz: 0.175Ω; Impedance (0V Bias) @ 50MHz: 0.064Ω; Impedance (0V Bias) @ 100MHz: 0.122Ω; Impedance (0V Bias) @ 500MHz: 0.525Ω; Impedance (0V Bias) @ 1GHz: 0.97Ω; Impedance (0V Bias) @ 2GHz: 2.26Ω; Impedance (0V Bias) @ 5GHz: 4.75Ω; Impedance (16V Bias) @ 100Hz: 2.55E+04Ω; Impedance (16V Bias) @ 500Hz: 5.18E+03Ω; Impedance (16V Bias) @ 1kHz: 2.61E+03Ω; Impedance (16V Bias) @ 5kHz: 529Ω; Impedance (16V Bias) @ 10kHz: 266Ω; Impedance (16V Bias) @ 50kHz: 54Ω; Impedance (16V Bias) @ 100kHz: 27.2Ω; Impedance (16V Bias) @ 500kHz: 5.5Ω; Impedance (16V Bias) @ 1MHz: 2.76Ω; Impedance (16V Bias) @ 5MHz: 0.587Ω; Impedance (16V Bias) @ 10MHz: 0.277Ω; Impedance (16V Bias) @ 50MHz: 0.0412Ω; Impedance (16V Bias) @ 100MHz: 0.133Ω; Impedance (16V Bias) @ 500MHz: 0.524Ω; Impedance (16V Bias) @ 1GHz: 0.969Ω; Impedance (16V Bias) @ 2GHz: 2.25Ω; Impedance (16V Bias) @ 5GHz: 4.7Ω; Package Size: 0402; JLCPCB Basic Part: Yes; JLCPCB Part Number: C1525; Supplier 1: LCSC; Category: Capacitors - MLCC; Supplier Part Number 1: C1525; Manufacturer Part Number: CL05B104KO5NNNC; Tolerance: ±10%; Voltage Rating: 16V; Temperature Coefficient: X7R; RoHS: Yes; ComponentLink1Description: Datasheet; ComponentLink1URL: https://wmsc.lcsc.com/wmsc/upload/file/pdf/v2/lcsc/2304140030_Samsung-Electro-Mechanics-CL05B104KO5NNNC_C1525.pdf; ComponentLink2Description: JLCPCB Part URL; ComponentLink2URL: https://jlcpcb.com/partdetail/C1525; ComponentLink3Description: LCSC Part URL; ComponentLink3URL: https://lcsc.com/product-detail/Multilayer-Ceramic-Capacitors-MLCC---SMD-SMT_Samsung-Electro-Mechanics-Samsung-Electro-Mechanics-CL05B104KO5NNNC_C1525.html; ComponentLink4Description: Samsung Component Library; ComponentLink4URL: https://weblib.samsungsem.com/mlcc/mlcc-ec.do?partNumber=CL05B104KO5NNN
D_LED1 D_LED2 = LTST-C190GKT: MF: {'manufacturer': u'Lite-On Inc.'}; Package: None; Price: None; Value: *; MP: LTST-C190GKT; Availability: Unavailable
H_OLED1 H_SD1 = 4-pin Header: 4-pin Header 0.1mm pitch
J_OLED = PPTC041LFBN-RC: 4 Position Header Connector 0.100 (2.54mm) Through Hole Tin; MF: Sullins Connector; SnapEDA_Link: https://www.snapeda.com/parts/PPTC041LFBN-RC/Sullins/view-part/?ref=snap; Package: None; Value: *; MP: PPTC041LFBN-RC; Check_prices: https://www.snapeda.com/parts/PPTC041LFBN-RC/Sullins/view-part/?ref=eda
R4-R11 R14 = 0402WGF1002TCE: Resistor, 10kΩ, ±1%, 62.5mW, 50V, ±100ppm/℃, -55℃~+155℃, SMD 0402; Manufacturer: Uniroyal; Supplier 1: LCSC; Manufacturer Part Number: 0402WGF1002TCE; Supplier Part Number 1: C25744; JLCPCB Part Number: C25744; Power Rating: 62.5mW; Category: Resistors; Package Size: 0402; JLCPCB Basic Part: Yes; Tolerance: ±1%; Voltage Rating: 50V; Temperature Coefficient: ±100ppm/℃; Temperature Rating: -55℃~+155℃; ComponentLink1Description: Datasheet; ComponentLink1URL: https://wmsc.lcsc.com/wmsc/upload/file/pdf/v2/lcsc/2206010100_UNI-ROYAL-Uniroyal-Elec-0402WGF1002TCE_C25744.pdf; ComponentLink2Description: JLCPCB Part URL; ComponentLink2URL: https://jlcpcb.com/partdetail/C25744
R12 R13 = 0402WGF220JTCE: Resistor, 22Ω, ±1%, 62.5mW, 50V, ±200ppm/℃, -55℃~+155℃, SMD 0402; Manufacturer: Uniroyal; Supplier 1: LCSC; Manufacturer Part Number: 0402WGF220JTCE; Supplier Part Number 1: C25092; JLCPCB Part Number: C25092; Power Rating: 62.5mW; Category: Resistors; Package Size: 0402; JLCPCB Basic Part: Yes; Tolerance: ±1%; Voltage Rating: 50V; Temperature Coefficient: ±200ppm/℃; Temperature Rating: -55℃~+155℃; ComponentLink1Description: Datasheet; ComponentLink1URL: https://wmsc.lcsc.com/wmsc/upload/file/pdf/v2/lcsc/2205311900_UNI-ROYAL-Uniroyal-Elec-0402WGF220JTCE_C25092.pdf; ComponentLink2Description: JLCPCB Part URL; ComponentLink2URL: https://jlcpcb.com/partdetail/C25092
R15 R16 = 0402WGF1000TCE: Resistor, 100Ω, ±1%, 62.5mW, 50V, ±200ppm/℃, -55℃~+155℃, SMD 0402; Manufacturer: Uniroyal; Supplier 1: LCSC; Manufacturer Part Number: 0402WGF1000TCE; Supplier Part Number 1: C25076; JLCPCB Part Number: C25076; Power Rating: 62.5mW; Category: Resistors; Package Size: 0402; JLCPCB Basic Part: Yes; Tolerance: ±1%; Voltage Rating: 50V; Temperature Coefficient: ±200ppm/℃; Temperature Rating: -55℃~+155℃; ComponentLink1Description: Datasheet; ComponentLink1URL: https://wmsc.lcsc.com/wmsc/upload/file/pdf/v2/lcsc/2205311900_UNI-ROYAL-Uniroyal-Elec-0402WGF1000TCE_C25076.pdf; ComponentLink2Description: JLCPCB Part URL; ComponentLink2URL: https://jlcpcb.com/partdetail/C25076
U1 = STM32L412KBT6: No Description Available; Mfr_Name: STMicroelectronics; RefDes: RefDes; Type: Type
X1 = SX3M32.768KM20F30TNN: Manufacturer: SCTF(星通时频); Add into BOM: yes; Normal temperature Frequency Tolerance: ±20ppm; Output Type: CMOS; Voltage - Supply: 1.62V~3.63V; Current - Supply: 90uA; Frequency Stability: ±30ppm; Symbol: SX3M32.768KM20F30TNN; Device: SX3M32.768KM20F30TNN; LCSC Part Name: 32.768kHz ±20ppm 1.62V~3.63V CMOS; Supplier Part: C2901582; Manufacturer Part: SX3M32.768KM20F30TNN; Supplier Footprint: SMD3225-4P; JLCPCB Part Class: Extended Part; Datasheet: https://atta.szlcsc.com/upload/public/pdf/source/20240605/38A6F081BC26201D4BADAAB4D2EED01C.pdf; Supplier: LCSC; Convert to PCB: yes; Value: 32.768kHz; Operating Temperature: -40℃~+85℃

## Sheet MicroSD.SchDoc
size A; SheetNumber: 4; SheetTotal: 8
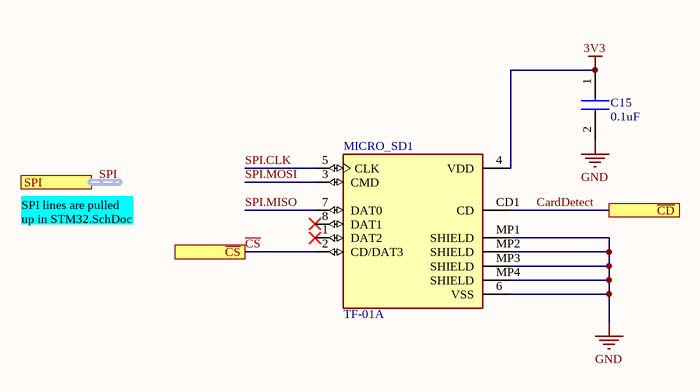
[diagram p3: MicroSD.SchDoc]

### Parts
C15  value 0.1uF  [CAPC1005X55N]  (hidden comment: 0.1uF Ceramic Capacitor)
MICRO_SD1  TF-01A  [TF-01A]

### Ports
SPI (harness SPI, see STM32[1D]), ~{CD} (see STM32[1D]), ~{CS} (see STM32[1D])

### Nets
3V3: C15.1 MICRO_SD1.4(VDD)
GND: C15.2 MICRO_SD1.6(VSS) MICRO_SD1.MP1(SHIELD) MICRO_SD1.MP2(SHIELD) MICRO_SD1.MP3(SHIELD) MICRO_SD1.MP4(SHIELD)
~{CS}: MICRO_SD1.2(CD/DAT3) ; port ~{CS}
CardDetect: MICRO_SD1.CD1(CD) ; port ~{CD}
SPI.CLK: MICRO_SD1.5(CLK)
SPI.MISO: MICRO_SD1.7(DAT0)
SPI.MOSI: MICRO_SD1.3(CMD)

Not connected (* = marked no-connect by the designer): MICRO_SD1 1(DAT2)* 8(DAT1)*

### Buses and harness runs
harness SPI = port SPI

### Notes on the sheet
- SPI lines are pulled up in STM32.SchDoc

### Library data of the parts
C15 = CL05B104KO5NNNC: Manufacturer_Name: SAMSUNG; Datasheet Link: https://datasheet.datasheetarchive.com/originals/distributors/Datasheets-DGA10/2408147.pdf; Height: 0.55mm; Manufacturer_Part_Number: CL05B104KO5NNNC; Mouser Part Number: 187-CL05B104KO5NNNC; Mouser Price/Stock: https://www.mouser.co.uk/ProductDetail/Samsung-Electro-Mechanics/CL05B104KO5NNNC?qs=hqM3L16%252BxlfT2SKOuAUq6Q%3D%3D; Arrow Part Number: CL05B104KO5NNNC; Arrow Price/Stock: https://www.arrow.com/en/products/cl05b104ko5nnnc/samsung-electro-mechanics?utm_currency=USD&region=europe
MICRO_SD1 = TF-01A: Standard Card Edge Connectors; MF: HRO Electronics Co., Ltd.; Price: None; Availability: Not in stock; MP: TF-01A; Package: Package; SnapEDA_Link: https://www.snapeda.com/parts/TF-01A/HRO+Electronics+Co.%252C+Ltd./view-part/?ref=snap; Check_prices: https://www.snapeda.com/parts/TF-01A/HRO+Electronics+Co.%252C+Ltd./view-part/?ref=eda; Value: *

## Sheet SWD.SchDoc
size A; SheetNumber: 6; SheetTotal: 8
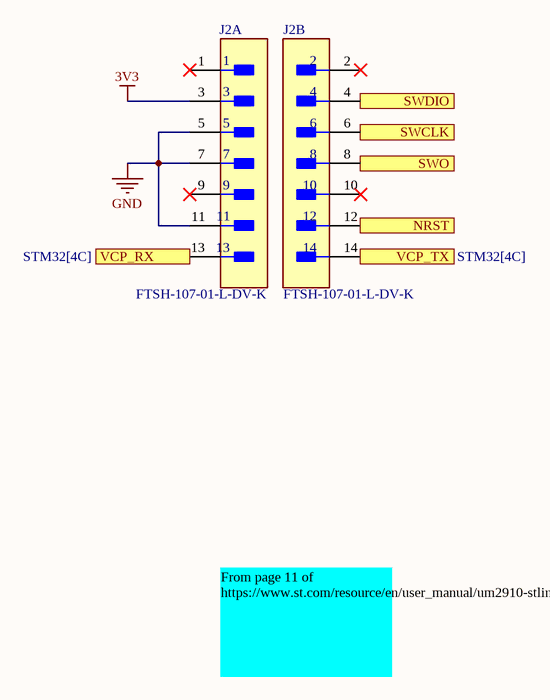
[diagram p4: SWD.SchDoc]

### Parts
J2  FTSH-107-01-L-DV-K  [FP-FTSH-107-01-L-DV-K-MFG]  (parts A,B of 2)

### Ports
NRST (see STM32[4C]), SWCLK (see STM32[4C]), SWDIO (see STM32[4C]), SWO (see STM32[4C]), VCP_RX (see STM32[4C]), VCP_TX (see STM32[4C])

### Nets
3V3: J2.3
GND: J2.5 J2.7 J2.11
MCU_VCP_RX: J2.14 ; port VCP_TX
MCU_VCP_TX: J2.13 ; port VCP_RX
NRST: J2.12 ; port NRST
SWCLK: J2.6 ; port SWCLK
SWDIO: J2.4 ; port SWDIO
SWO: J2.8 ; port SWO

Not connected (* = marked no-connect by the designer): J2 1* 2* 9* 10*

### Notes on the sheet
- From page 11 of
  https://www.st.com/resource/en/user_manual/um2910-stlinkv3minie-debuggerprogrammer-tiny-probe-for-stm32-microcontrollers-stmicroelectronics.pdf

### Library data of the parts
J2 = CMP-02766-001412-1: CONN HEADER SMD 14POS 1.27MM; Number of Contacts: 14; Gender: Male; Termination: Solder; Lead Free: Lead Free; Depth: 5.84mm; Min Operating Temperature: -55°C; Length: 8.89mm; RoHS Compliant: Yes; Housing Material: Polymer; Housing Color: Black; Max Operating Temperature: 125°C; Number of Rows: 2; Pitch: 1.27mm; Radiation Hardening: No; Orientation: Straight; Packaging: Rail/Tube; Contact Material: Bronze; Contact Plating: Gold

## Sheet Fuse.SchDoc
size A; SheetNumber: 2; SheetTotal: 8
Used 2 times, as channels F1, F2. Parts and nets are listed once, with the designators drawn on the sheet.
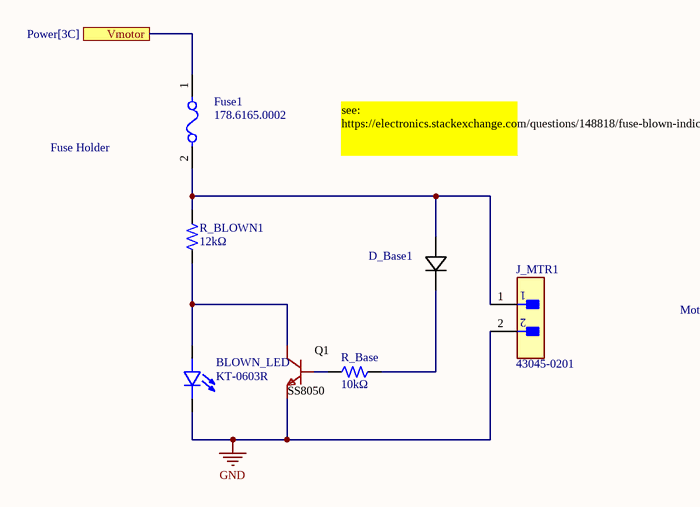
[diagram p5: Fuse.SchDoc]

### Parts
BLOWN_LED  KT-0603R  [LED_KT-0603R]
D_Base1  Diode  [M7_MDD]  (value not drawn)
Fuse1  178.6165.0002  [FP-178_6165-MFG]
J_MTR1  43045-0201  [FP-43045-0201-MFG]
Q1  SS8050  [SOT-23-3_L2.9-W1.3-P1.90-LS2.4-BR]
R_Base  Resistance: 10kΩ  [RES-0603]  (hidden comment: 0603WAF1002T5E)
R_BLOWN1  Resistance: 12kΩ  [RES-0402]  (hidden comment: 0402WGF1202TCE)

### Ports
Vmotor (see Power[3C])

### Nets
GND: BLOWN_LED.C J_MTR1.2 Q1.2(E)
Vmotor: Fuse1.1 ; port Vmotor
NetBLOWN_LED_A: BLOWN_LED.A Q1.3(C) R_BLOWN1.1
NetD_Base1_1: D_Base1.1(CATHODE) R_Base.2
NetD_Base1_2: D_Base1.2(ANODE) Fuse1.2 J_MTR1.1 R_BLOWN1.2
NetQ1_1: Q1.1(B) R_Base.1

### Channels
F1: designators end in A; ports Vmotor=Vmotor1
F2: designators end in B; ports Vmotor=Vmotor2

### Notes on the sheet
- (near Fuse1) Fuse Holder
- see: https://electronics.stackexchange.com/questions/148818/fuse-blown-indicator-circuits-compilation
- (near J_MTR1) Motor Power Connector

### Library data of the parts
BLOWN_LED = KT-0603R: Red 0603 Light Emitting Diodes; MF: Hubei KENTO Elec; SnapEDA_Link: https://www.snapeda.com/parts/KT-0603R/Hubei+KENTO+Elec/view-part/?ref=snap; Package: Package; Value: *; MP: KT-0603R; Check_prices: https://www.snapeda.com/parts/KT-0603R/Hubei+KENTO+Elec/view-part/?ref=eda
D_Base1 = M7: 1A Independent Type 1kV 1.1V@1A SMA(DO-214AC) Diodes - General Purpose ROHS; Mfr_Name: Microdiode Electronics
Fuse1 = CMP-08604-000022-1: FUSE HOLDER BLADE 80V PCB; Manufacturer: Littelfuse; Standoff Height: 1mm; Number Of Fuses: 1; Conn Orientation: Vertical; Device Class L1: Circuit Protection; Height: 17.5mm; Mouser Description: Fuse Holder FLR (ATO) PCB 4-pin Holder; Device Class L3: unset; Lead Free: Yes; Digikey Description: FUSE HOLDER BLADE 80V PCB; Voltage Rating Ac: 80V; ComponentLink2Description: Datasheet; Manufacturer Part Number: 178.6165.0002; Voltage Rating Dc: 80V; Automotive: No; Octopart: https://octopart.com/178.6165.0002-littelfuse-13138759; Device Class L2: Fuse Holders; Package: 178.6165; RoHS: TRUE; ComponentLink2URL: https://www.littelfuse.com/~/media/commercial-vehicle/datasheets/automotive-fuse-holders/ato/littelfuse-fuse-holder-ato-flr-pcb-datasheet.pdf; Category: Fuse
J_MTR1 = CMP-04776-000998-1: as J1_PWR on sheet Power; Number of Positions: 2; Halogen Free: Low Halogen; Series: 43045; Mount: Through Hole; Packaging: Tray; Row Spacing: 3mm; Contact Material: Brass; Radiation Hardening: No; Number of Contacts: 2; Orientation: Right Angle; Max Operating Temperature: 105°C; Housing Material: Thermoplastic; Contact Plating: Gold; Case/Package: 0201; Number of Rows: 2; Min Operating Temperature: -40°C; Termination: Solder; Package Quantity: 3168
Q1 = SS8050(RANGE:200-350)_C2150: BJT NPN; Manufacturer: CJ(江苏长电/长晶); Symbol: SS8050_C2150; Add into BOM: yes; DC Current Gain (hFE@Ic,Vce): 200@800mA,1V; Transition Frequency (fT): 100MHz; Collector Cut-Off Current (Icbo): 100nA; Collector-Emitter Saturation Voltage (VCE(sat)@Ic,Ib): 500mV@800mA,80mA; Device: SS8050(RANGE:200-350)_C2150; LCSC Part Name: NPN 电流:1.5A 耐压:25V hfe=200~350; Supplier Part: C2150; Manufacturer Part: SS8050(RANGE:200-350); Supplier Footprint: SOT-23; JLCPCB Part Class: Basic Part; Datasheet: https://atta.szlcsc.com/upload/public/pdf/source/20230322/AEE86F4B043774EFF80CAEA14A37D9E9.pdf; Supplier: LCSC; Convert to PCB: yes; Operating Temperature: -55℃~+150℃
R_Base = 0603WAF1002T5E: Resistor, 10kΩ, ±1%, 100mW, 75V, ±100ppm/℃, -55℃~+155℃, SMD 0603; Manufacturer: Uniroyal; Supplier 1: LCSC; Manufacturer Part Number: 0603WAF1002T5E; Supplier Part Number 1: C25804; JLCPCB Part Number: C25804; Power Rating: 100mW; Category: Resistors; Package Size: 0603; JLCPCB Basic Part: Yes; Tolerance: ±1%; Voltage Rating: 75V; Temperature Coefficient: ±100ppm/℃; Temperature Rating: -55℃~+155℃; ComponentLink1Description: Datasheet; ComponentLink1URL: https://wmsc.lcsc.com/wmsc/upload/file/pdf/v2/lcsc/2206010045_UNI-ROYAL-Uniroyal-Elec-0603WAF1002T5E_C25804.pdf; ComponentLink2Description: JLCPCB Part URL; ComponentLink2URL: https://jlcpcb.com/partdetail/C25804
R_BLOWN1 = 0402WGF1202TCE: Resistor, 12kΩ, ±1%, 62.5mW, 50V, ±100ppm/℃, -55℃~+155℃, SMD 0402; Manufacturer: Uniroyal; Supplier 1: LCSC; Manufacturer Part Number: 0402WGF1202TCE; Supplier Part Number 1: C25752; JLCPCB Part Number: C25752; Power Rating: 62.5mW; Category: Resistors; Package Size: 0402; JLCPCB Basic Part: Yes; Tolerance: ±1%; Voltage Rating: 50V; Temperature Coefficient: ±100ppm/℃; Temperature Rating: -55℃~+155℃; ComponentLink1Description: Datasheet; ComponentLink1URL: https://wmsc.lcsc.com/wmsc/upload/file/pdf/v2/lcsc/2206010100_UNI-ROYAL-Uniroyal-Elec-0402WGF1202TCE_C25752.pdf; ComponentLink2Description: JLCPCB Part URL; ComponentLink2URL: https://jlcpcb.com/partdetail/C25752

## Sheet Regulator3V3.SchDoc
size A; SheetNumber: 8; SheetTotal: 8
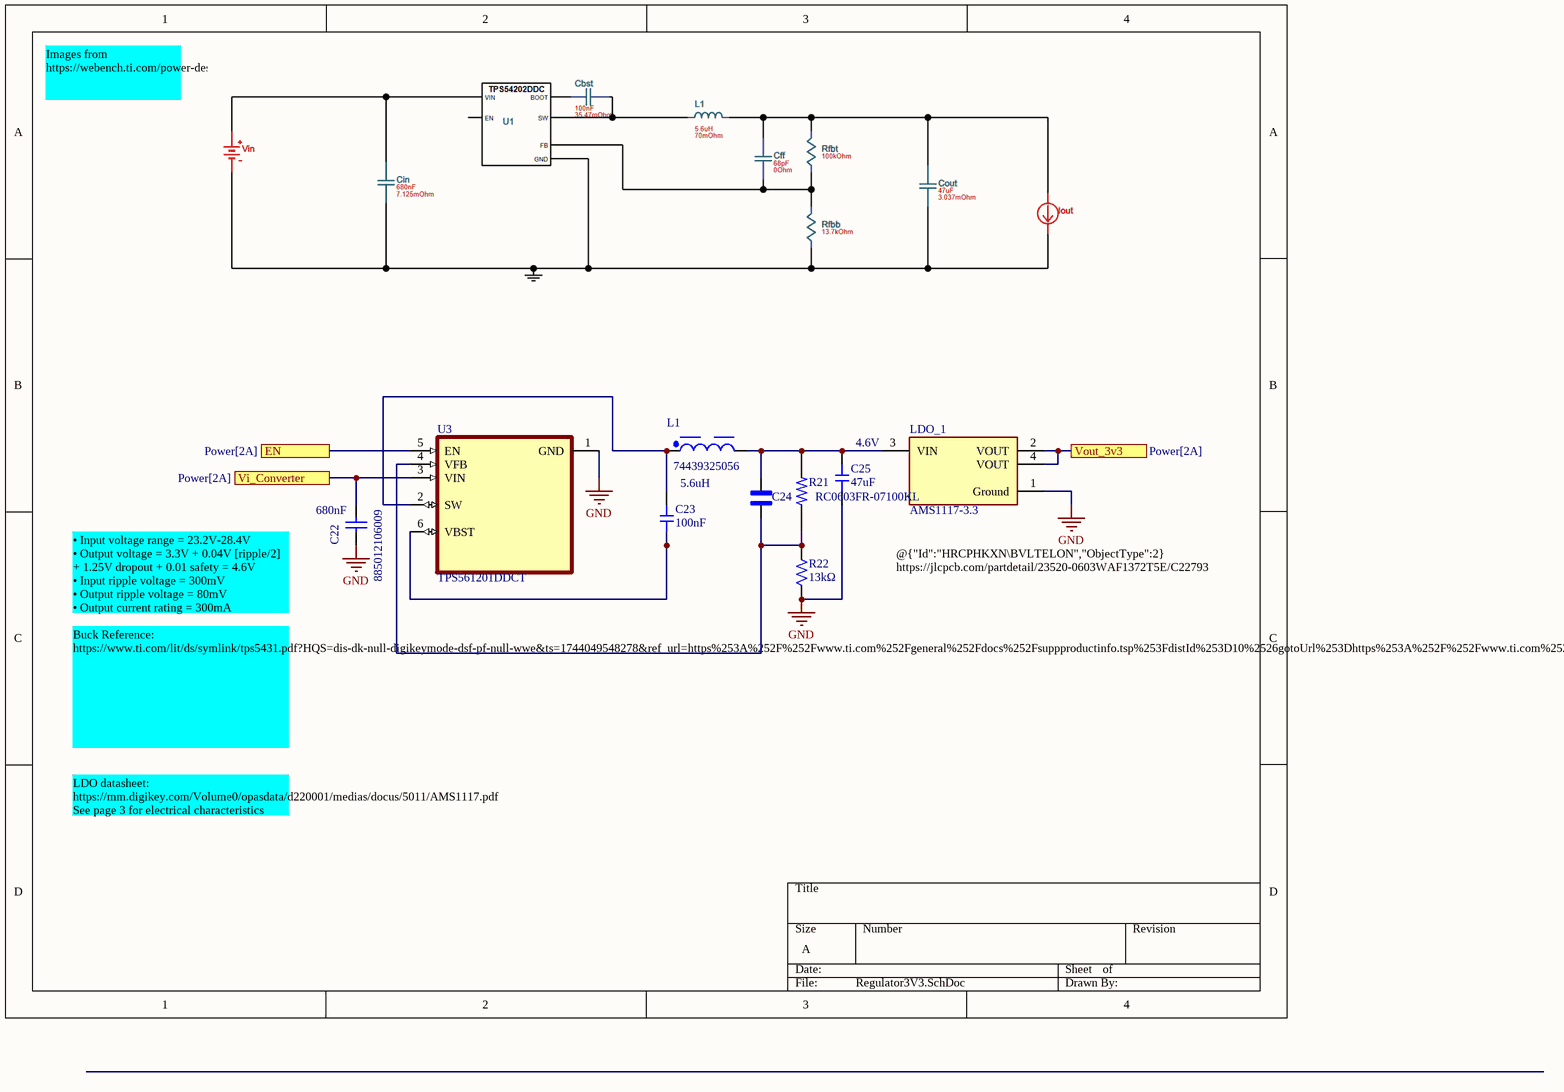
[diagram p6: Regulator3V3.SchDoc]

### Parts
C22  885012106009  Capacitance: 680nF  [WCAP-CSGP_0603_L1.6W0.8H0.8_Reflow]
C23  Capacitance: 100nF  [CAP-0402]  (hidden comment: CL05B104KO5NNNC)
C24  CGA1A2C0G1E680J030BA  [CAPC0603X33N]  (value not drawn)
C25  Capacitance: 47uF  [CAP-0805]  (hidden comment: CL21A476MQYNNNE)
L1  74439325056  Parameter 1: 5.6uH  [WE-XHMI_4040]
LDO_1  AMS1117-3.3  [FP-AMS1117-IPC_C]
R21  RC0603FR-07100KL  [RESC1607X60N]
R22  Resistance: 13kΩ  [RES-0603]  (hidden comment: 0603WAF1302T5E)
U3  TPS561201DDCT  [SOT95P280X110-6N]

### Ports
EN (see Power[2A]), Vi_Converter (see Power[2A]), Vout_3v3 (see Power[2A])

### Nets
3V3: U3.5(EN) ; port EN
26V: C22.2 U3.3(VIN) ; port Vi_Converter
GND: C22.1 C25.1 LDO_1.1(Ground) R22.1 U3.1(GND)
STM_Vdd: LDO_1.2(VOUT) LDO_1.4(VOUT) ; port Vout_3v3
NetC23_1: C23.1 U3.6(VBST)
NetC23_2: C23.2 L1.1 U3.2(SW)
NetC24_1: C24.1 R21.1 R22.2 U3.4(VFB)
NetC24_2: C24.2 C25.2 L1.2 LDO_1.3(VIN) R21.2

### Notes on the sheet
- Images from
  https://webench.ti.com/power-designer/switching-regulator?powerSupply=0
- 4.6V
- • Input voltage range = 23.2V-28.4V
  • Output voltage = 3.3V + 0.04V [ripple/2] + 1.25V dropout + 0.01 safety = 4.6V
  • Input ripple voltage = 300mV
  • Output ripple voltage = 80mV
  • Output current rating = 300mA
  • Operating frequency = 500kHz
- @{"Id":"HRCPHKXN\BVLTELON","ObjectType":2}
  https://jlcpcb.com/partdetail/23520-0603WAF1372T5E/C22793
- Buck Reference:
  https://www.ti.com/lit/ds/symlink/tps5431.pdf?HQS=dis-dk-null-digikeymode-dsf-pf-null-wwe&ts=1744049548278&ref_url=https%253A%252F%252Fwww.ti.com%252Fgeneral%252Fdocs%252Fsuppproductinfo.tsp%253FdistId%253D10%2526gotoUrl%253Dhttps%253A%252F%252Fwww.ti.com%252Flit%252Fgpn%252Ftps5431
- LDO datasheet:
  https://mm.digikey.com/Volume0/opasdata/d220001/medias/docus/5011/AMS1117.pdf
  See page 3 for electrical characteristics

### Library data of the parts
C22 = CMP-03913-53914714-2: Cap Cer 0.68UF 10V X5R 0603; Tolerance: 20%; Insulation Resistance: 200MΩ; Width: 800µm; Case Code (Imperial): 0603; Min Operating Temperature: -55°C; Mount: Surface Mount; Dielectric: X5R; Max Operating Temperature: 85°C; Length: 1.6mm; Height: 800µm; Thickness: 939.8µm; RoHS: Compliant; Packaging: Tape & Reel (TR); Voltage Rating (DC): 10V; Case Code (Metric): 1608; Case/Package: 0603; Voltage Rating: 10V
C23 = CL05B104KO5NNNC: as C6 on sheet STM32; Package Size: 0402; JLCPCB Basic Part: Yes; JLCPCB Part Number: C1525; Supplier 1: LCSC; Category: Capacitors - MLCC; Supplier Part Number 1: C1525; Manufacturer Part Number: CL05B104KO5NNNC; Tolerance: ±10%; Voltage Rating: 16V; Temperature Coefficient: X7R; RoHS: Yes; ComponentLink1Description: Datasheet; ComponentLink1URL: https://wmsc.lcsc.com/wmsc/upload/file/pdf/v2/lcsc/2304140030_Samsung-Electro-Mechanics-CL05B104KO5NNNC_C1525.pdf; ComponentLink2Description: JLCPCB Part URL; ComponentLink2URL: https://jlcpcb.com/partdetail/C1525; ComponentLink3Description: LCSC Part URL; ComponentLink3URL: https://lcsc.com/product-detail/Multilayer-Ceramic-Capacitors-MLCC---SMD-SMT_Samsung-Electro-Mechanics-Samsung-Electro-Mechanics-CL05B104KO5NNNC_C1525.html; ComponentLink4Description: Samsung Component Library; ComponentLink4URL: https://weblib.samsungsem.com/mlcc/mlcc-ec.do?partNumber=CL05B104KO5NNN
C24 = CGA1A2C0G1E680J030BA: 68 pF Â±5% 25V Ceramic Capacitor C0G, NP0 0201 (0603 Metric); MF: TDK; SnapEDA_Link: https://www.snapeda.com/parts/CGA1A2C0G1E680J030BA/TDK/view-part/?ref=snap; Package: 0603 Taiyo Yuden; Value: *; MP: CGA1A2C0G1E680J030BA; Check_prices: https://www.snapeda.com/parts/CGA1A2C0G1E680J030BA/TDK/view-part/?ref=eda
C25 = CL21A476MQYNNNE: Capacitor, Ceramic (MLCC), 47uF, ±20%, 6.3V, X5R, ±20%, SMD 0805; Manufacturer: Samsung Electro-Mechanics; Temperature Rating: -55°C ~ 85°C; Capacitance @ 1V DC Bias: 37.588uF; Capacitance @ 1.2V DC Bias: 35.744uF; Capacitance @ 1.35V DC Bias: 34.267uF; Capacitance @ 1.5V DC Bias: 32.775uF; Capacitance @ 1.8V DC Bias: 29.885uF; Capacitance @ 2.5V DC Bias: 24.262uF; Capacitance @ 3.3V DC Bias: 18.956uF; Capacitance @ 3.7V DC Bias: 16.988uF; Capacitance @ 4.2V DC Bias: 14.989uF; Capacitance @ 5V DC Bias: 12.411uF; Impedance (0V Bias) @ 100Hz: 51.8Ω; Impedance (0V Bias) @ 500Hz: 10.7Ω; Impedance (0V Bias) @ 1kHz: 5.39Ω; Impedance (0V Bias) @ 5kHz: 1.11Ω; Impedance (0V Bias) @ 10kHz: 0.559Ω; Impedance (0V Bias) @ 50kHz: 0.115Ω; Impedance (0V Bias) @ 100kHz: 0.0576Ω; Impedance (0V Bias) @ 500kHz: 0.00947Ω; Impedance (0V Bias) @ 1MHz: 0.00305Ω; Impedance (0V Bias) @ 5MHz: 0.0134Ω; Impedance (0V Bias) @ 10MHz: 0.0218Ω; Impedance (0V Bias) @ 50MHz: 0.0701Ω; Impedance (0V Bias) @ 100MHz: 0.113Ω; Impedance (0V Bias) @ 500MHz: 0.391Ω; Impedance (0V Bias) @ 1GHz: 0.706Ω; Impedance (0V Bias) @ 2GHz: 1.8Ω; Impedance (0V Bias) @ 5GHz: 2.67Ω; Package Size: 0805; JLCPCB Basic Part: Yes; JLCPCB Part Number: C16780; Supplier 1: LCSC; Category: Capacitors - MLCC; Supplier Part Number 1: C16780; Manufacturer Part Number: CL21A476MQYNNNE; Tolerance: ±20%; Voltage Rating: 6.3V; Temperature Coefficient: X5R; RoHS: Yes; ComponentLink1Description: Datasheet; ComponentLink1URL: https://wmsc.lcsc.com/wmsc/upload/file/pdf/v2/lcsc/2304140030_Samsung-Electro-Mechanics-CL21A476MQYNNNE_C16780.pdf; ComponentLink2Description: JLCPCB Part URL; ComponentLink2URL: https://jlcpcb.com/partdetail/C16780; ComponentLink3Description: LCSC Part URL; ComponentLink3URL: https://lcsc.com/product-detail/Multilayer-Ceramic-Capacitors-MLCC---SMD-SMT_Samsung-Electro-Mechanics-Samsung-Electro-Mechanics-CL21A476MQYNNNE_C16780.html; ComponentLink4Description: Samsung Component Library; ComponentLink4URL: https://weblib.samsungsem.com/mlcc/mlcc-ec.do?partNumber=CL21A476MQYNNN
L1 = CMP-03913-148605660-1: Power Inductor, 5.6UH, Shielded, 5.1A Rohs Compliant: Yes
LDO_1 = CMP-209535-000001-1: LDO Voltage Regulators 1A, 3.3V; Manufacturer: Advanced Monolithic Systems; Dropout Voltage: 1.1V; Output Type: Fixed; Nominal Supply Current: 5mA; Max Power Dissipation: 1.2W; Max Supply Voltage: 15V; Number Of Outputs: 1; Standoff Height: 0.64mm; Max Junction Temp: +125°C; Height: 1.8mm; Package: AMS1117; Device Class L2: Power Management ICs; ComponentLink2Description: Datasheet; ComponentLink2URL: http://www.advanced-monolithic.com/pdf/ds1117.pdf; Category: IC; RoHS: TRUE; Automotive: No; Device Class L1: Integrated Circuits (ICs); Output Current: 1A; Device Class L3: Voltage Regulators - Linear; Temperature: -40°C to +125°C; Output Voltage: 3.3V; Manufacturer Part Number: AMS1117-3.3; Temperature Range Low: -40°C; Octopart: https://octopart.com/ams1117-3.3-advanced+monolithic+systems-25899300; Lead Free: Yes; Ipc Land Pattern Name: SOT229P700X180-4; Temperature Range High: +125°C
R21 = RC0603FR-07100KL: 100 kOhms Â±1% 0.1W, 1/10W Chip Resistor 0603 (1608 Metric) Moisture Resistant Thick Film; MF: Yageo; SnapEDA_Link: https://www.snapeda.com/parts/RC0603FR-07100KL/Yageo/view-part/?ref=snap; Package: 0603 Yageo; Value: *; MP: RC0603FR-07100KL; Check_prices: https://www.snapeda.com/parts/RC0603FR-07100KL/Yageo/view-part/?ref=eda
R22 = 0603WAF1302T5E: Resistor, 13kΩ, ±1%, 100mW, 75V, ±100ppm/℃, -55℃~+155℃, SMD 0603; Manufacturer: Uniroyal; Supplier 1: LCSC; Manufacturer Part Number: 0603WAF1302T5E; Supplier Part Number 1: C22797; JLCPCB Part Number: C22797; Power Rating: 100mW; Category: Resistors; Package Size: 0603; JLCPCB Basic Part: Yes; Tolerance: ±1%; Voltage Rating: 75V; Temperature Coefficient: ±100ppm/℃; Temperature Rating: -55℃~+155℃; ComponentLink1Description: Datasheet; ComponentLink1URL: https://wmsc.lcsc.com/wmsc/upload/file/pdf/v2/lcsc/2206010130_UNI-ROYAL-Uniroyal-Elec-0603WAF1302T5E_C22797.pdf; ComponentLink2Description: JLCPCB Part URL; ComponentLink2URL: https://jlcpcb.com/partdetail/C22797
U3 = TPS561201DDCT: 4.5V to 17V Input, 1A Synchronous Step-Down Voltage Regulator in 6-pin SOT-23; MF: Texas Instruments; SnapEDA_Link: https://www.snapeda.com/parts/TPS561201DDCT/Texas+Instruments/view-part/?ref=snap; Package: SOT-23-THN-6 Texas Instruments; Value: *; MP: TPS561201DDCT; Check_prices: https://www.snapeda.com/parts/TPS561201DDCT/Texas+Instruments/view-part/?ref=eda

## Nets that join several sheets
3V3: I1 (C9A.2 R17A.2 U2A.12), I2 (C9B.2 R17B.2 U2B.12), STM32 (11 pins), MicroSD (C15.1 MICRO_SD1.4), SWD (J2.3), Regulator3V3 (U3.5)
26V: Power (J1_PWR.1 R1.2), Regulator3V3 (C22.2 U3.3)
GND: Power (J1_PWR.2 R3.1), I1 (C9A.1 C10A.1 U2A.5), I2 (C9B.1 C10B.1 U2B.5), STM32 (19 pins), MicroSD (6 pins), SWD (J2.5 J2.7 J2.11), F1 (BLOWN_LEDA.C J_MTR1A.2 Q1A.2), F2 (BLOWN_LEDB.C J_MTR1B.2 Q1B.2), Regulator3V3 (5 pins)
~{CS}: STM32 (H_SD1.4 U1.20), MicroSD (MICRO_SD1.2)
ADC1_IN9: I1 (C10A.2 U2A.11), STM32 (U1.10)
ADC1_IN10: I2 (C10B.2 U2B.11), STM32 (U1.11)
CardDetect: STM32 (U1.19), MicroSD (MICRO_SD1.CD1)
MCU_VCP_RX: STM32 (U1.25), SWD (J2.14)
MCU_VCP_TX: STM32 (U1.8), SWD (J2.13)
NRST: STM32 (B_RST1.A1 B_RST1.B1 C2.2 U1.4), SWD (J2.12)
OPAMP1_VINP: Power (R2.1 R3.2), STM32 (U1.6)
STM_Vdd: STM32 (6 pins), Regulator3V3 (LDO_1.2 LDO_1.4)
SWCLK: STM32 (R4.1 U1.24), SWD (J2.6)
SWDIO: STM32 (R5.1 R13.1), SWD (J2.4)
SWO: STM32 (R9.1 R12.2), SWD (J2.8)
Vmotor1: I1 (U2A.3), F1 (Fuse1A.1)
Vmotor2: I2 (U2B.3), F2 (Fuse1B.1)